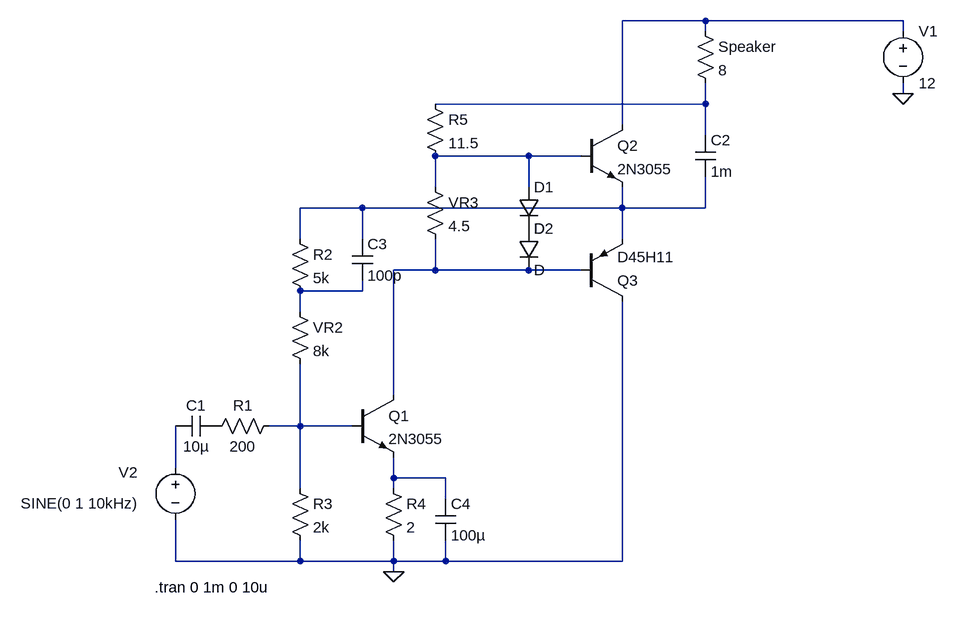
[diagram p0: schematic Class-AB Push Pull.asc]
Class-AB Push Pull.asc, the LTspice schematic file:
Version 4
SHEET 1 1168 680
WIRE 800 -416 672 -416
WIRE 1104 -416 800 -416
WIRE 800 -400 800 -416
WIRE 1104 -400 1104 -416
WIRE 1104 -304 1104 -320
WIRE 800 -288 800 -320
WIRE 800 -288 384 -288
WIRE 672 -256 672 -416
WIRE 800 -240 800 -288
WIRE 528 -208 384 -208
WIRE 608 -208 528 -208
WIRE 384 -160 384 -208
WIRE 528 -160 528 -208
WIRE 272 -128 176 -128
WIRE 672 -128 672 -160
WIRE 672 -128 272 -128
WIRE 800 -128 800 -176
WIRE 800 -128 672 -128
WIRE 176 -80 176 -128
WIRE 272 -80 272 -128
WIRE 672 -80 672 -128
WIRE 384 -32 384 -80
WIRE 384 -32 320 -32
WIRE 528 -32 384 -32
WIRE 608 -32 528 -32
WIRE 272 0 272 -16
WIRE 272 0 176 0
WIRE 176 32 176 0
WIRE 320 160 320 -32
WIRE 176 208 176 112
WIRE 176 208 128 208
WIRE 256 208 176 208
WIRE -16 272 -16 208
WIRE 320 288 320 256
WIRE 400 288 320 288
WIRE 176 304 176 208
WIRE 320 304 320 288
WIRE 400 320 400 288
WIRE -16 416 -16 352
WIRE 176 416 176 384
WIRE 176 416 -16 416
WIRE 320 416 320 384
WIRE 320 416 176 416
WIRE 400 416 400 384
WIRE 400 416 320 416
WIRE 672 416 672 16
WIRE 672 416 400 416
WIRE 320 432 320 416
FLAG 1104 -304 0
FLAG 320 432 0
SYMBOL res 160 288 R0
SYMATTR InstName R3
SYMATTR Value 2k
SYMBOL res 160 16 R0
SYMATTR InstName VR2
SYMATTR Value 8k
SYMBOL res 160 -96 R0
SYMATTR InstName R2
SYMATTR Value 5k
SYMBOL res 304 288 R0
SYMATTR InstName R4
SYMATTR Value 2
SYMBOL cap 384 320 R0
SYMATTR InstName C4
SYMATTR Value 100µ
SYMBOL cap 256 -80 R0
SYMATTR InstName C3
SYMATTR Value 100p
SYMBOL diode 512 -160 R0
SYMATTR InstName D1
SYMBOL diode 512 -96 R0
SYMATTR InstName D2
SYMBOL res 368 -176 R0
SYMATTR InstName VR3
SYMATTR Value 4.5
SYMBOL res 368 -304 R0
SYMATTR InstName R5
SYMATTR Value 11.5
SYMBOL res 784 -416 R0
SYMATTR InstName Speaker
SYMATTR Value 8
SYMBOL cap 784 -240 R0
SYMATTR InstName C2
SYMATTR Value 1m
SYMBOL voltage 1104 -416 R0
WINDOW 123 0 0 Left 0
WINDOW 39 0 0 Left 0
SYMATTR InstName V1
SYMATTR Value 12
SYMBOL voltage -16 256 R0
WINDOW 123 0 0 Left 0
WINDOW 39 0 0 Left 0
WINDOW 0 -87 23 Left 2
WINDOW 3 -238 71 Left 2
SYMATTR InstName V2
SYMATTR Value SINE(0 1 10kHz)
SYMBOL cap 48 192 R90
WINDOW 0 0 32 VBottom 2
WINDOW 3 32 32 VTop 2
SYMATTR InstName C1
SYMATTR Value 10µ
SYMBOL res 144 192 R90
WINDOW 0 0 56 VBottom 2
WINDOW 3 32 56 VTop 2
SYMATTR InstName R1
SYMATTR Value 200
SYMBOL npn3 256 160 R0
SYMATTR InstName Q1
SYMATTR Value 2N3055
SYMBOL npn3 608 -256 R0
SYMATTR InstName Q2
SYMATTR Value 2N3055
SYMBOL pnp2 608 16 M180
SYMATTR InstName Q3
SYMATTR Value D45H11
TEXT -48 456 Left 2 !.tran 0 1m 0 10u

The netlist it stands for:
* Class-AB Push Pull.asc
R3 N007 0 2k
R§VR2 N006 N007 8k
R2 N004 N006 5k
R4 N009 0 2
C4 N009 0 100µ
C3 N004 N006 100p
D1 N003 P001 D
D2 P001 N005 D
R§VR3 N003 N005 4.5
R5 N002 N003 11.5
R§Speaker N001 N002 8
C2 N002 N004 1m
V1 N001 0 12
V2 N008 0 SINE(0 1 10kHz)
C1 P002 N008 10µ
R1 N007 P002 200
Q1 N005 N007 N009 0 2N3055
Q2 N001 N003 N004 0 2N3055
Q3 0 N005 N004 0 D45H11
.model D D
.lib standard.dio
.model NPN NPN
.model PNP PNP
.lib standard.bjt
.tran 0 1m 0 10u
.backanno
.end